# EAGLE design femtoBeacon_PRO_r3.0.0_single_sided (EAGLE 7.5.0)

## Sheet 1 of 2
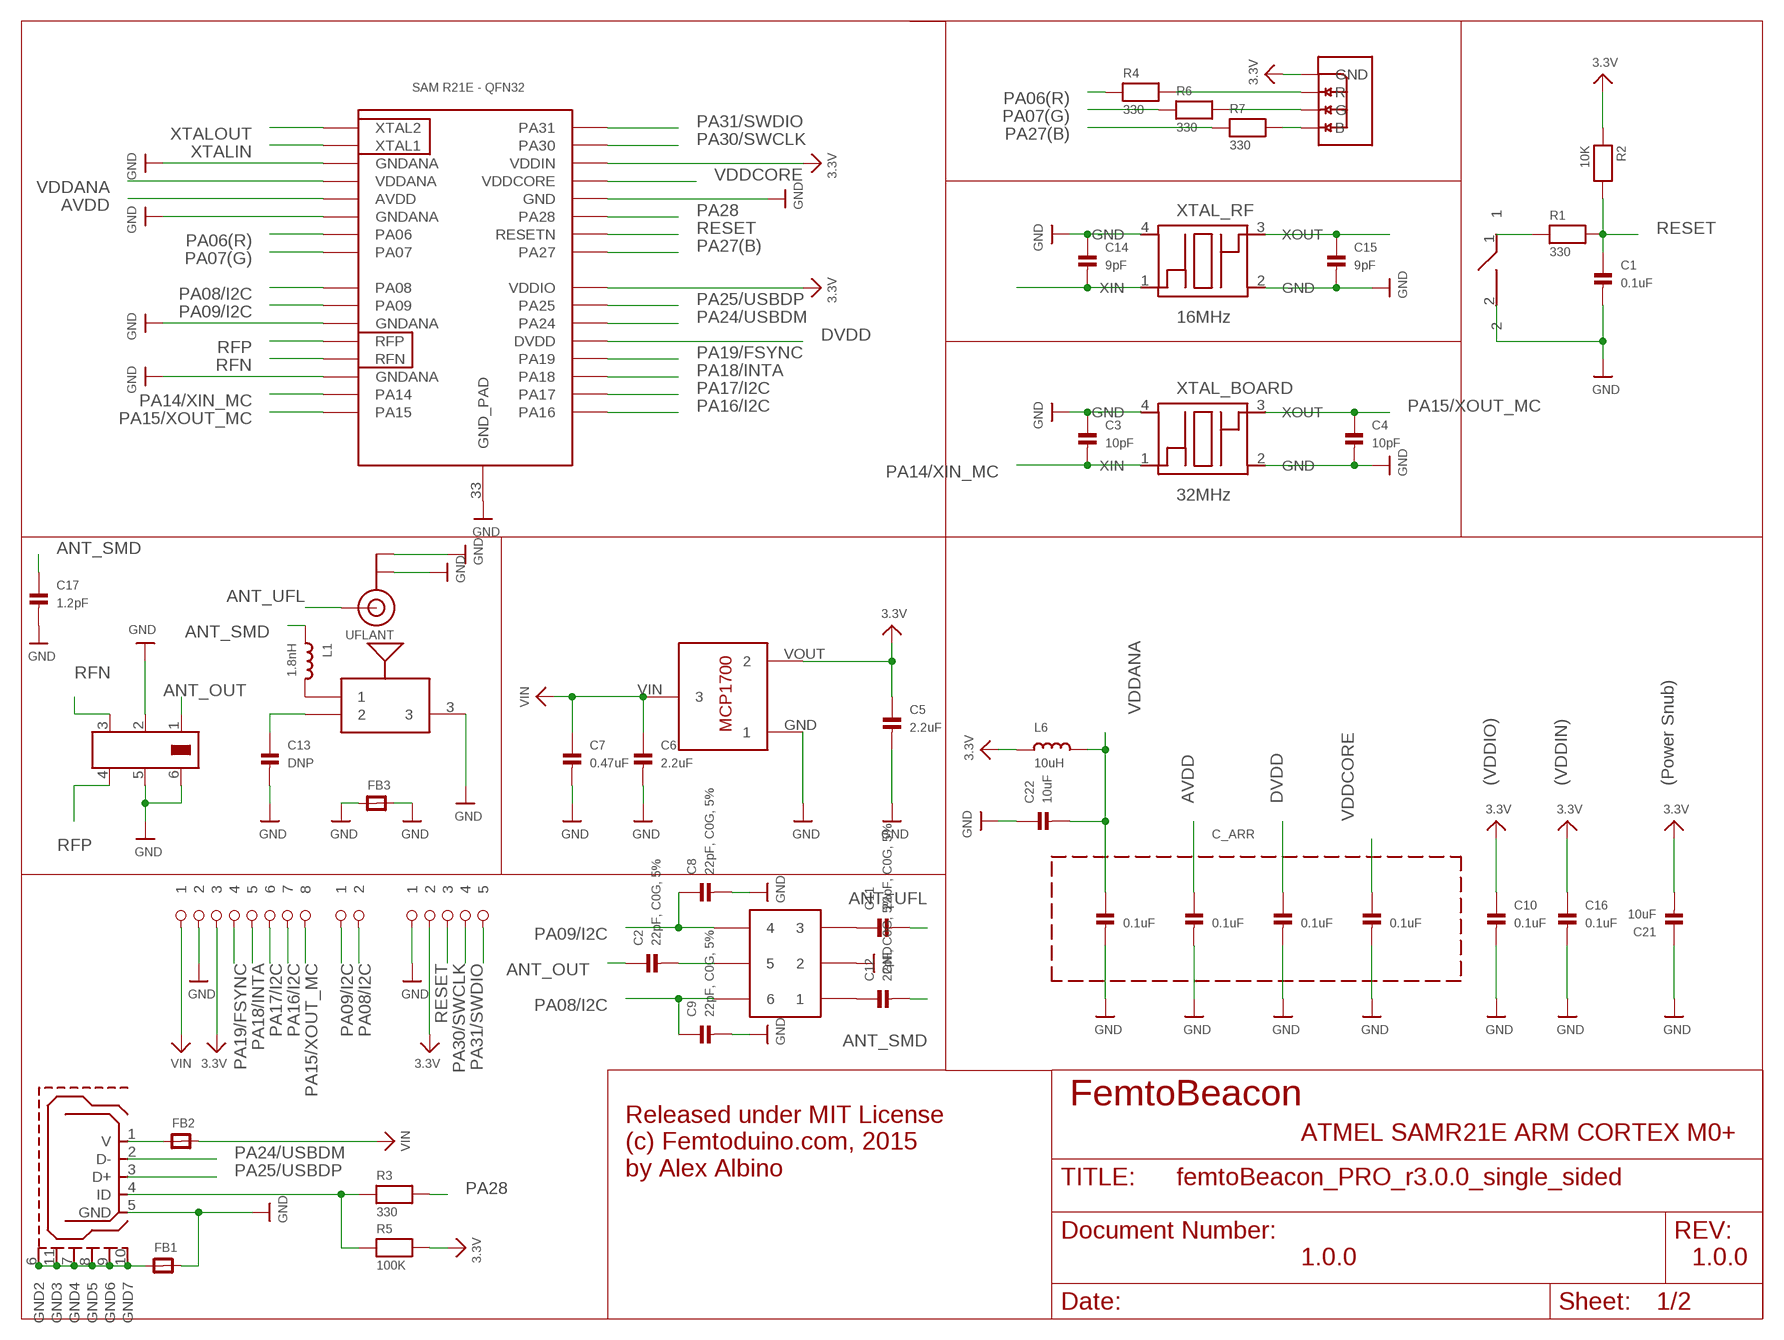
[diagram p0: schematic, sheet 1]

### Parts
ASWITCH  AS222-92LF  [AS222-92LF]
BALUN  JOHANSON_2450BM15A0015E  [0805_BALUN]
BTN_RESET  DNP  SPST_SMD  [SPST_SMD]
C1  0.1uF  CAP_CERAMIC_0402MP  [_0402MP]
C2  22pF, C0G, 5%  CAP_CERAMIC_0402MP  [_0402MP]
C3  10pF  CAP_CERAMIC_0402MP  [_0402MP]
C4  10pF  CAP_CERAMIC_0402MP  [_0402MP]
C5  2.2uF  CAP_CERAMIC_0402MP  [_0402MP]
C6  2.2uF  CAP_CERAMIC_0402MP  [_0402MP]
C7  0.47uF  CAP_CERAMIC_0402MP  [_0402MP]
C8  22pF, C0G, 5%  CAP_CERAMIC_0402MP  [_0402MP]
C9  22pF, C0G, 5%  CAP_CERAMIC_0402MP  [_0402MP]
C10  0.1uF  CAP_CERAMIC_0402MP  [_0402MP]
C11  22pF, C0G, 5%  CAP_CERAMIC_0402MP  [_0402MP]
C12  22pF, C0G, 5%  CAP_CERAMIC_0402MP  [_0402MP]
C13  DNP  CAP_CERAMIC_0402MP  [_0402MP]
C14  9pF  CAP_CERAMIC_0402MP  [_0402MP]
C15  9pF  CAP_CERAMIC_0402MP  [_0402MP]
C16  0.1uF  CAP_CERAMIC_0402MP  [_0402MP]
C17  1.2pF  CAP_CERAMIC_0402MP  [_0402MP]
C21  10uF  CAP_CERAMIC_0402MP  [_0402MP]
C22  10uF  CAP_CERAMIC_0402MP  [_0402MP]
C_ARR  0.1uF  KEMET_CERAMIC_CAPACITOR_ARRAY_1X4  [CAPACITOR_ARRAY_1206_MONO_1X4]
FB1  FERRITE_0603MP  [_0603MP]
FB2  FERRITE_0603MP  [_0603MP]
FB3  FERRITE_0603MP  [_0603MP]
IC  ATSAMR21E18A-MUT  [QFN32]
L1  1.8nH  INDUCTOR_0603MP  [_0603MP]
L6  10uH  INDUCTOR_0603MP  [_0603MP]
LDO_VREG  MCP1700T-3302E/TT  [MCP1700T-3302E/TT]
R1  330  RESISTOR_0402MP  [_0402MP]
R2  10K  RESISTOR_0402MP  [_0402MP]
R3  330  RESISTOR_0402MP  [_0402MP]
R4  330  RESISTOR_0402MP  [_0402MP]
R5  100K  RESISTOR_0402MP  [_0402MP]
R6  330  RESISTOR_0402MP  [_0402MP]
R7  330  RESISTOR_0402MP  [_0402MP]
RGBLED  LRTB_R48G  [LRTB_R48G]
SMDANT  PULSE_ANT_2.4GHZ  [ANT_BAR]
U$5  1X8_ROUND  [1X8_ROUND]
U$9  1X2_ROUND  [1X2_ROUND]
U$10  1X5_ROUND  [1X5_ROUND]
UFLANT  ANTENNA_U.FL  [U.FL]
USB  USB_MICROB  [USB_MICROB_PACKAGE]
XTAL_BOARD  32MHz  FA-128  [FA-128]
XTAL_RF  16MHz  TSX-3225  [TSX-3225]

### Nets
3.3V: C5.1 C10.1 C16.1 C21.2 IC.24(VDDIO) IC.30(VDDIN) L6.1 LDO_VREG.VOUT R2.1 R5.2 RGBLED.1(GND) U$5.P$3 U$10.P$2 ; also sheet 2
ANT_OUT: BALUN.1 C2.1
ANT_SMD: C12.2 C17.1 L1.1
ANT_UFL: C11.2 UFLANT.3(SIGNAL)
AVDD: C_ARR.3 IC.5(AVDD)
DVDD: C_ARR.5 IC.21(DVDD)
GND: ASWITCH.PIN2 BALUN.2 BALUN.5 BALUN.6 BTN_RESET.2 C1.2 C3.1 C4.2 C5.2 C6.2 C7.2 C8.2 C9.2 C10.2 C13.2 C14.1 C15.2 C16.2 C17.2 C21.1 C22.1 C_ARR.2 C_ARR.4 C_ARR.6 C_ARR.8 FB1.2 FB3.1 FB3.2 IC.3(GNDANA) IC.6(GNDANA) IC.11(GNDANA) IC.14(GNDANA) IC.28(GND) IC.33(GND_PAD) LDO_VREG.GND SMDANT.3 U$5.P$2 U$10.P$1 UFLANT.1(GND) UFLANT.2(GND) USB.5(GND) XTAL_BOARD.2(GND) XTAL_BOARD.4(GND) XTAL_RF.2(GND) XTAL_RF.4(GND) ; also sheet 2
N$1: L1.2 SMDANT.1
N$2: C13.1 SMDANT.2
N$3: ASWITCH.PIN5 C2.2
N$5: FB1.1 USB.6(GND2) USB.7(GND4) USB.8(GND5) USB.9(GND6) USB.10(GND7) USB.11(GND3)
N$6: R3.1 R5.1 USB.4(ID)
N$7: FB2.1 USB.1(V)
N$8: R6.2 RGBLED.3(G)
N$9: R7.2 RGBLED.4(B)
N$10: ASWITCH.PIN3 C11.1
N$11: ASWITCH.PIN1 C12.1
N$13: R4.2 RGBLED.2(R)
N$26: BTN_RESET.1 R1.1
PA06(R): IC.7(PA06) R4.1
PA07(G): IC.8(PA07) R6.1
PA08/I2C: ASWITCH.PIN6 C9.1 IC.9(PA08) U$9.P$2
PA09/I2C: ASWITCH.PIN4 C8.1 IC.10(PA09) U$9.P$1
PA14/XIN_MC: C3.2 IC.15(PA14) XTAL_BOARD.1(XIN)
PA15/XOUT_MC: C4.1 IC.16(PA15) U$5.P$8 XTAL_BOARD.3(XOUT)
PA16/I2C: IC.17(PA16) U$5.P$7 ; also sheet 2
PA17/I2C: IC.18(PA17) U$5.P$6 ; also sheet 2
PA18/INTA: IC.19(PA18) U$5.P$5 ; also sheet 2
PA19/FSYNC: IC.20(PA19) U$5.P$4 ; also sheet 2
PA24/USBDM: IC.22(PA24) USB.2(D-)
PA25/USBDP: IC.23(PA25) USB.3(D+)
PA27(B): IC.25(PA27) R7.1
PA28: IC.27(PA28) R3.2
PA30/SWCLK: IC.31(PA30) U$10.P$4
PA31/SWDIO: IC.32(PA31) U$10.P$5
RESET: C1.1 IC.26(RESETN) R1.2 R2.2 U$10.P$3
RFN: BALUN.3 IC.13(RFN)
RFP: BALUN.4 IC.12(RFP)
VDDANA: C22.2 C_ARR.1 IC.4(VDDANA) L6.2
VDDCORE: C_ARR.7 IC.29(VDDCORE)
VIN: C6.1 C7.1 FB2.2 LDO_VREG.VIN U$5.P$1
XTALIN: C14.2 IC.2(XTAL1) XTAL_RF.1(XIN)
XTALOUT: C15.1 IC.1(XTAL2) XTAL_RF.3(XOUT)

### Notes on the sheet
- (VDDIO) | (VDDIN) | (Power Snub)
- FemtoBeacon
- ATMEL SAMR21E ARM CORTEX M0+
- Released under MIT License
  (c) Femtoduino.com, 2015
  by Alex Albino
- 1.0.0 | 1.0.0

## Sheet 2 of 2
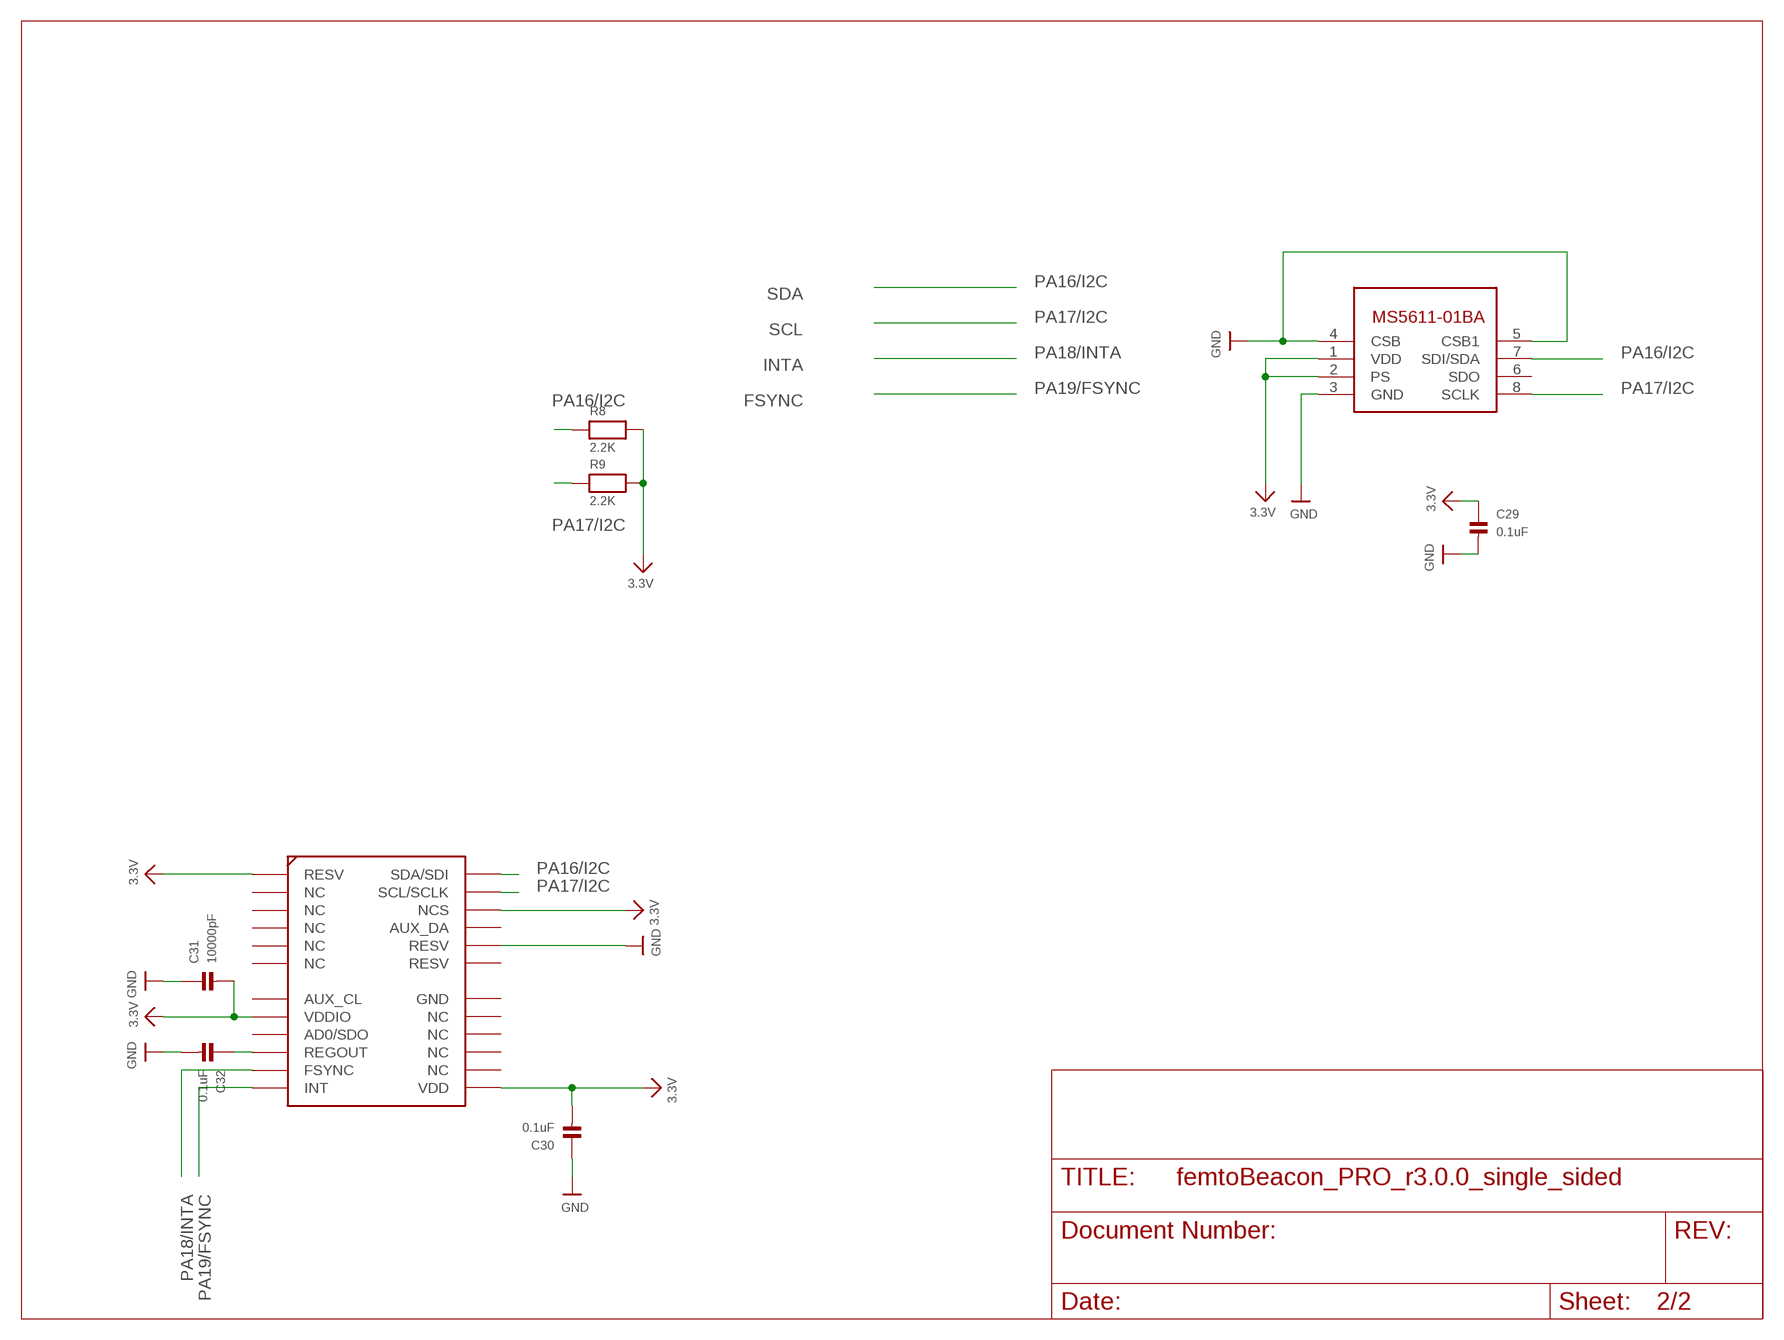
[diagram p1: schematic, sheet 2]

### Parts
BARO  MS5611-01BA03  [MS5611-01BA03]
C29  0.1uF  CAP_CERAMIC_0402MP  [_0402MP]
C30  0.1uF  CAP_CERAMIC_0402MP  [_0402MP]
C31  10000pF  CAP_CERAMIC_0402MP  [_0402MP]
C32  0.1uF  CAP_CERAMIC_0402MP  [_0402MP]
IMU  MPU-9250  [QFN_3X3MM]
R8  2.2K  RESISTOR_0402MP  [_0402MP]
R9  2.2K  RESISTOR_0402MP  [_0402MP]

### Nets
3.3V: BARO.1(VDD) BARO.2(PS) C29.1 C30.2 C31.2 IMU.P$1(RESV) IMU.P$8(VDDIO) IMU.P$13(VDD) IMU.P$22(NCS) R8.2 R9.2 ; also sheet 1
GND: BARO.3(GND) BARO.4(CSB) BARO.5(CSB1) C29.2 C30.1 C31.1 C32.2 IMU.P$20(RESV) ; also sheet 1
N$4: C32.1 IMU.P$10(REGOUT)
PA16/I2C: BARO.7(SDI/SDA) IMU.P$24(SDA/SDI) R8.1 ; also sheet 1
PA17/I2C: BARO.8(SCLK) IMU.P$23(SCL/SCLK) R9.1 ; also sheet 1
PA18/INTA: IMU.P$11(FSYNC) ; also sheet 1
PA19/FSYNC: IMU.P$12(INT) ; also sheet 1
Unconnected: BARO.6(SDO) IMU.P$2(NC) IMU.P$3(NC) IMU.P$4(NC) IMU.P$5(NC) IMU.P$6(NC) IMU.P$7(AUX_CL) IMU.P$9(AD0/SDO) IMU.P$14(NC) IMU.P$15(NC) IMU.P$16(NC) IMU.P$17(NC) IMU.P$18(GND) IMU.P$19(RESV) IMU.P$21(AUX_DA)

### Notes on the sheet
- SDA
- SCL
- INTA
- FSYNC

## Library data of the parts
ASWITCH = skyworks_solutions:AS222-92LF
BALUN = balun:JOHANSON_2450BM15A0015E
BARO = freeimu:MS5611-01BA03
BTN_RESET = femtoduino:SPST_SMD
C1-C4 C8-C16 C29-C32 = microbuilder:CAP_CERAMIC: Ceramic Capacitors 0402 - 0402 Surface Mount Capacitors 16pF 50V 5% [Digikey: 445-4899-2-ND] 18pF 50V 5% [Digikey: 490-1281-2-ND] 22pF 50V 5% [Digikey: 490-1283-2-ND] 68pF 50V 5% [Digikey: 490-1289-2-ND] 0.1uF 10V 10% [Digikey: 490-1318-2-ND] 1.0uF 6.3V 10% [Digikey: 490-1320-2-ND] 0603 - 0603 Surface Mount Capacitors 16 pF 50V 5% [Digikey: 445-5051-2-ND] 22 pF 50V [Digikey: PCC220ACVTR-ND] 33 pF 50V 5% [Digikey: 490-1415-1-ND] 56pF 50V 5% [Digikey: 490-1421-1-ND] 220pF 50V 5% [Digikey: 445-1285-1-ND] 680 pF 50V 2200 pF 50V 5% C0G [Digikey: 445-1297-1-ND] 5600 pF 100V 5% X7R [Digikey: 478-3711-1-ND] 0.1 µF 25V 10% [Digikey: PCC2277TR-ND] 0.22 µF 16V 10% X7R [Digikey: 445-1318-1-ND] 1.0 µF 25V 10% [Digikey: 445-5146-2-ND] 0603 - RF Specific 3pF 250V +/-0.1pF RF [Digikey: 712-1347-1-ND] 18 pF 250V 5% [Digikey: 478-3505-1-ND or 712-1322-1-ND] 56 pF 250V 5% C0G RF [Digikey: 490-4867-1-ND] 68 pF 250V RF [Digikey: 490-4868-1-ND] 0805 - 0805 Surface Mount Capacitors 220 pF 250V 2% RF Ceramic Capacitor [Digikey: 712-1398-1-ND] 1000 pF 50V 2% NP0 Ceramic Capacitor [Digikey: 478-3760-1-ND] 0.1 µF 25V 10% Ceramic Capacitor [Digikey: PCC1828TR-ND] 1.0 µF 16V 10% Ceramic Capacitor[Digikey: 490-1691-2-ND] 10.0 µF 10V 10% Ceramic Capacitor[Digikey: 709-1228-1-ND] 10.0 uF 16V 10% Ceramic Capacitor [Digikey: 478-5165-2-ND] 47 uF 6.3V 20% Ceramic Capacitor [Digikey: 587-1779-1-ND or 399-5506-1-ND] 1206 - 1206 Surface Mount Capacitors 47uF 10V 20% Ceramic Capacitor [Digikey: 490-5528-1-ND or 399-5508-1-ND or 445-6010-1-ND] 100uF 6.3V -20%, +80% Y5V Ceramic Capacitor (Digikey: 490-4512-1-ND, Mouser: 81-GRM31CF50J107ZE1L); DIGIKEY_PART: 490-3194-1-ND
C5-C7 C17 C21 C22 = microbuilder:CAP_CERAMIC: Ceramic Capacitors 0402 - 0402 Surface Mount Capacitors 16pF 50V 5% [Digikey: 445-4899-2-ND] 18pF 50V 5% [Digikey: 490-1281-2-ND] 22pF 50V 5% [Digikey: 490-1283-2-ND] 68pF 50V 5% [Digikey: 490-1289-2-ND] 0.1uF 10V 10% [Digikey: 490-1318-2-ND] 1.0uF 6.3V 10% [Digikey: 490-1320-2-ND] 0603 - 0603 Surface Mount Capacitors 16 pF 50V 5% [Digikey: 445-5051-2-ND] 22 pF 50V [Digikey: PCC220ACVTR-ND] 33 pF 50V 5% [Digikey: 490-1415-1-ND] 56pF 50V 5% [Digikey: 490-1421-1-ND] 220pF 50V 5% [Digikey: 445-1285-1-ND] 680 pF 50V 2200 pF 50V 5% C0G [Digikey: 445-1297-1-ND] 5600 pF 100V 5% X7R [Digikey: 478-3711-1-ND] 0.1 µF 25V 10% [Digikey: PCC2277TR-ND] 0.22 µF 16V 10% X7R [Digikey: 445-1318-1-ND] 1.0 µF 25V 10% [Digikey: 445-5146-2-ND] 0603 - RF Specific 3pF 250V +/-0.1pF RF [Digikey: 712-1347-1-ND] 18 pF 250V 5% [Digikey: 478-3505-1-ND or 712-1322-1-ND] 56 pF 250V 5% C0G RF [Digikey: 490-4867-1-ND] 68 pF 250V RF [Digikey: 490-4868-1-ND] 0805 - 0805 Surface Mount Capacitors 220 pF 250V 2% RF Ceramic Capacitor [Digikey: 712-1398-1-ND] 1000 pF 50V 2% NP0 Ceramic Capacitor [Digikey: 478-3760-1-ND] 0.1 µF 25V 10% Ceramic Capacitor [Digikey: PCC1828TR-ND] 1.0 µF 16V 10% Ceramic Capacitor[Digikey: 490-1691-2-ND] 10.0 µF 10V 10% Ceramic Capacitor[Digikey: 709-1228-1-ND] 10.0 uF 16V 10% Ceramic Capacitor [Digikey: 478-5165-2-ND] 47 uF 6.3V 20% Ceramic Capacitor [Digikey: 587-1779-1-ND or 399-5506-1-ND] 1206 - 1206 Surface Mount Capacitors 47uF 10V 20% Ceramic Capacitor [Digikey: 490-5528-1-ND or 399-5508-1-ND or 445-6010-1-ND] 100uF 6.3V -20%, +80% Y5V Ceramic Capacitor (Digikey: 490-4512-1-ND, Mouser: 81-GRM31CF50J107ZE1L)
C_ARR = array-capacitor:KEMET_CERAMIC_CAPACITOR_ARRAY_1X4; MFR_ID: CA064C104K4RACTU
FB1-FB3 = microbuilder:FERRITE: Ferrite Bead 0603 MMZ1608B121C - 120 Ohm @ 100MHz, 600mA, 0.15 Ohm DC Resistance - Digikey: 445-2164-1-ND BK1608HW121-T - 120 Ohm, 600mA Ferrite Chip - Digikey: 587-1876-2-ND 0805 HZ0805B272R-10 - 2.7K Ohm @ 100MHz, 200mA, 0.8 Ohm DC Resistance - Digikey: 240-2504-1-ND (see also Murata BLM21BD272SN1L) MMZ2012Y152B - 1.5K Ohm @ 100MHz, 500mA, 0.4 Ohm DC Resistance - Digikey: 445-1560-1-ND - Mainly for high frequency (80-400MHz) MMZ2012R102A - 1K Ohm @ 100MHz, 500mA, 0.3 Ohm DC Resistance - Digikey: 445-1555-2-ND - More general purpose (10-200MHz)
IC = atmel-samr21:ATSAMR21E18A-MUT: This is the ATMEL SAMR21E QFN-32. ATSAMR21E18A
IMU = mpu9250:MPU-9250
L1 = microbuilder:INDUCTOR: Inductors 0603: 10nH Ceramic Inductor - microwire antenna/RF (Digikey: 712-1434-2-ND) 0805: 560nH Ceramic Inductor - RF (Digikey: 553-1047-1-ND) 270nH Ceramic Inductor - Q = 40@250MHz, +-5%, 1 Ohm DC Resistance (Digikey: 535-10506-2-ND) 1007 (2518 Metric) SMT: 10µH 10% 250mOhm 820mA 1007 Inductor (Digikey: 587-2189-1-ND) 22µH 10% 500mOhm 580mA 1007 Inductor (Digikey: 587-2190-1-ND) 47µH 10% 950mOhm 420mA 1007 Inductor (Digikey: 587-2191-1-ND) 47µH 5% 100mOhm 1A 1008 Inductor (Digikey: 732-1816-1-ND) 5.0x5.0mm (Taiyo Yuden NR5040 Series) 6.8µH 20% 2.3A 64mOhm Inductor (Digikey: 587-2374-2-ND) 5.0x5.0mm (TDK VLC5045 Series) 4.7µH 20% 3.3A 34mOhm Inductor (Digikey: 445-6526-1-ND) 6.8µH 20% 2.7A 46mOhm Inductor (Digikey: 445-6527-1-ND) 6.0x6.0mm (TDK VLC6045 Series) 4.7µH 20% 3.8A 27mOhm Inductor (Digikey: 445-6538-2-ND) 6.8µH 20% 3A 41mOhm Inductor (Digikey: 445-6540-1-ND) 6.2µH 30% 2.2A 45mOhm Inductor (Digikey: SRR5028-6R2YCT-ND) - Not TDK VLC6045 but footprint should match 6.0x6.0mm (TDK SLF6045 Series) 6.8uH 30% 2A 33mOhm Inductor (Digikey: 445-4572-1-ND, Mouser: 810-SLF645T6R8N2R0PF); MFR_ID: L-05B1N8SV6T
L6 = microbuilder:INDUCTOR: Inductors 0603: 10nH Ceramic Inductor - microwire antenna/RF (Digikey: 712-1434-2-ND) 0805: 560nH Ceramic Inductor - RF (Digikey: 553-1047-1-ND) 270nH Ceramic Inductor - Q = 40@250MHz, +-5%, 1 Ohm DC Resistance (Digikey: 535-10506-2-ND) 1007 (2518 Metric) SMT: 10µH 10% 250mOhm 820mA 1007 Inductor (Digikey: 587-2189-1-ND) 22µH 10% 500mOhm 580mA 1007 Inductor (Digikey: 587-2190-1-ND) 47µH 10% 950mOhm 420mA 1007 Inductor (Digikey: 587-2191-1-ND) 47µH 5% 100mOhm 1A 1008 Inductor (Digikey: 732-1816-1-ND) 5.0x5.0mm (Taiyo Yuden NR5040 Series) 6.8µH 20% 2.3A 64mOhm Inductor (Digikey: 587-2374-2-ND) 5.0x5.0mm (TDK VLC5045 Series) 4.7µH 20% 3.3A 34mOhm Inductor (Digikey: 445-6526-1-ND) 6.8µH 20% 2.7A 46mOhm Inductor (Digikey: 445-6527-1-ND) 6.0x6.0mm (TDK VLC6045 Series) 4.7µH 20% 3.8A 27mOhm Inductor (Digikey: 445-6538-2-ND) 6.8µH 20% 3A 41mOhm Inductor (Digikey: 445-6540-1-ND) 6.2µH 30% 2.2A 45mOhm Inductor (Digikey: SRR5028-6R2YCT-ND) - Not TDK VLC6045 but footprint should match 6.0x6.0mm (TDK SLF6045 Series) 6.8uH 30% 2A 33mOhm Inductor (Digikey: 445-4572-1-ND, Mouser: 810-SLF645T6R8N2R0PF)
LDO_VREG = MCP1700T-3302E_TT:MCP1700T-3302E/TT: Microchip LDO "MCP1700" in a 3-Pin SOT-23 package. ID: MCP1700T-3302E/TT
R1-R9 = microbuilder:RESISTOR: Resistors 0402 - 0402 Surface Mount Package 22 Ohm 1% 1/16W [Digikey: 311-22.0LRTR-ND] 33 Ohm 5% 1/16W 1.0K 5% 1/16W 1.5K 5% 1/16W 2.0K 1% 1/16W 10.0K 1% 1/16W [Digikey: 311-10.0KLRTR-ND] 10.0K 5% 1/16W [Digikey: RMCF0402JT10K0TR-ND] 12.1K 1% 1/16W [Digikey: 311-22.0LRTR-ND] 100.0K 5% 1/16W 0603 - 0603 Surface Mount Package 0 Ohm 1/10 Watt 1% Resistor 15 Ohm 1/10 Watt 1% Resistor 33 Ohm 1/10 Watt 1% Resistor 49.9 Ohm 1/10 Watt 1% Resistor 100 Ohm 1/10 Watt 1% Resistor 150 Ohm 1/10 Watt 1% Resistor 240 Ohm 1/10 Watt 1% Resistor 390 Ohm 1/10 Watt 1% Resistor 560 Ohm 1/10 Watt 1% Resistor 680 Ohm 1/10 Watt 1% Resistor 750 Ohm 1/10 Watt 1% Resistor 1.0K Ohm 1/10 Watt 1% Resistor 1.5K Ohm 1/10 Watt 1% Resistor 2.0K Ohm 1/10 Watt 1% Resistor 2.2K Ohm 1/10 Watt 1% Resistor 3.3K Ohm 1/10 Watt 1% Resistor 4.7K Ohm 1/10 Watt 1% Resistor 10.0K Ohm 1/10 Watt 1% Resistor 12.0K Ohm 1/10 Watt 1% Resistor 12.1K Ohm 1/10 Watt 1% Resistor 20.0K Ohm 1/10 Watt 1% Resistor 33.0K Ohm 1/10 Watt 1% Resistor 100.0K Ohm 1/10 Watt 1% Resistor 0805 - 0805 Surface Mount Package 0 Ohm 1/8 Watt 1% Resistor 33 Ohm 1/8 Watt 1% Resistor 100 Ohm 1/8 Watt 1% Resistor 150 Ohm 1/8 Watt 1% Resistor 200 Ohm 1/8 Watt 1% Resistor 240 Ohm 1/8 Watt 1% Resistor 330 Ohm 1/8 Watt 1% Resistor 390 Ohm 1/8 Watt 1% Resistor 470 Ohm 1/8 Watt 1% Resistor 1.0K Ohm 1/8 Watt 1% Resistor 1.5K Ohm 1/8 Watt 1% Resistor 2.0K Ohm 1/8 Watt 1% Resistor 4.7K Ohm 1/8 Watt 1% Resistor 5.1K Ohm 1/8 Watt 1% Resistor 5.6K Ohm 1/8 Watt 1% Resistor 10.0K Ohm 1/8 Watt 1% Resistor 22.0K Ohm 1/8 Watt 1% Resistor 33.0K Ohm 1/8 Watt 1% Resistor 100K Ohm 1/8 Watt 1% Resistor 1206 - 1206 Surface Mount Package 2012 - 2010 Surface Mount Package 0.11 Ohm 1/2 Watt 1% Resistor - Digikey: RHM.11UCT-ND
RGBLED = osram_opto_LED:LRTB_R48G; MFR_ID: LRTB R48G
SMDANT = bar_antenna:PULSE_ANT_2.4GHZ: Manufacturer part #W3008
U$5 = pins_1.27mm_pitch:1X8_ROUND
U$9 = pins_1.27mm_pitch:1X2_ROUND
U$10 = pins_1.27mm_pitch:1X5_ROUND
UFLANT = adafruit:ANTENNA_U.FL: U.FL Antenna Connector
USB = femtoduino:USB_MICROB: This is the hirose ZX62-B-5PA(11) MICRO-USB B Type female connection.
XTAL_BOARD = crystals:FA-128
XTAL_RF = crystals:TSX-3225

## Board
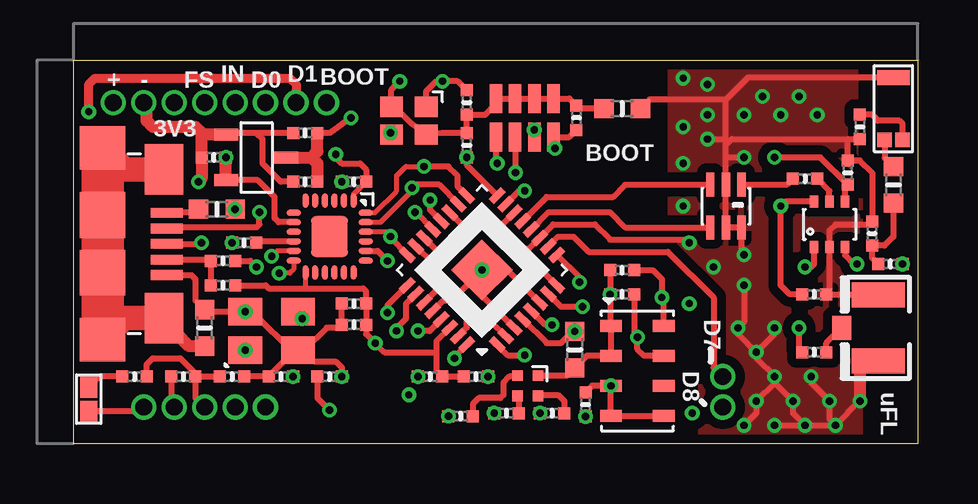
[diagram p2: board, top side]
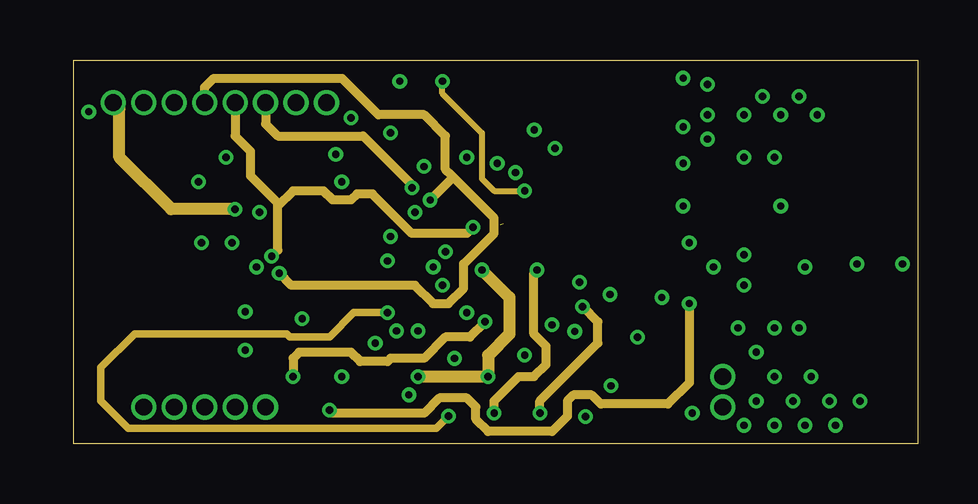
[diagram p3: board, inner layer Route2]
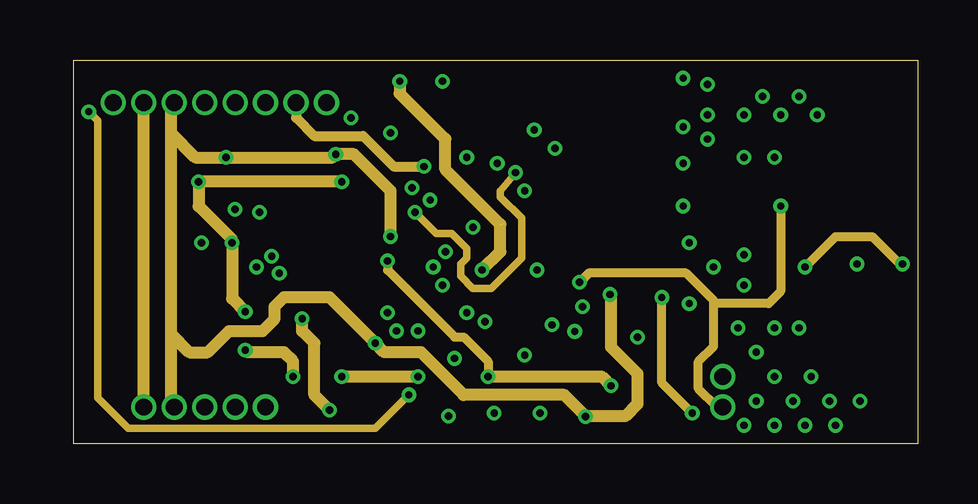
[diagram p4: board, inner layer Route15]
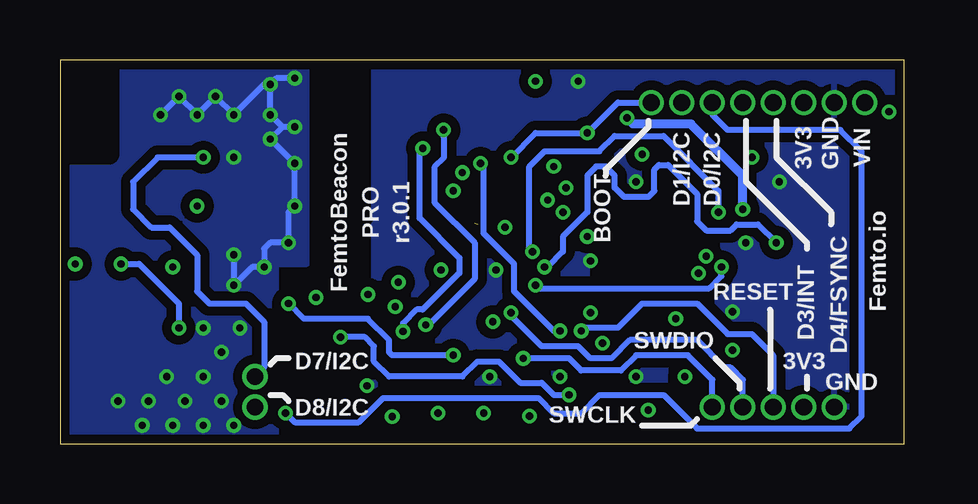
[diagram p5: board, bottom side, seen from below]

Size 35.18 x 16 mm. Coordinates in mm from the lower left corner, seen from the top.
Outline: 0,0 0,16 35.18,16 35.18,0 0,0
Copper layers (1*2*15*16): Top 0.035mm / dielectric 0.23mm / Route2 0.035mm / dielectric 0.93mm / Route15 0.035mm / dielectric 0.23mm / Bottom 0.035mm
Design rules "MF_Standard_4_Layer": minimum track width 6mil, minimum drill 12mil, track to track 6mil, track to pad 6mil, pad to pad 6mil, via to via 6mil, smd to smd 0mil, copper to edge 10mil, drill to drill 10mil, minimum pad ring 6mil, minimum via ring 6mil, stop-mask expansion 2mil, vias tented up to drill 25mil, thermal gap 10mil
tRestrict: area 33.1,12.1 to 35.2,16; area 9.1,7.1 to 12.2,10.2
bRestrict: area 33.1,12.1 to 35.2,16; area 9.1,7.1 to 12.2,10.2

### Footprints (pad centres in the part's own frame; a part is rotated, then mirrored left to right if it is on the bottom)
AS222-92LF = smd 0.35 x 0.5: PIN1 -0.65,-0.95; PIN2 0,-0.95; PIN3 0.65,-0.95; PIN4 0.65,0.95; PIN5 0,0.95; PIN6 -0.65,0.95
0805_BALUN = smd 1 x 0.35: 1 -0.9,0.65; 2 -0.9,0; 3 -0.9,-0.65; 4 0.9,-0.65; 5 0.9,0; 6 0.9,0.65
MS5611-01BA03 = smd 0.9 x 0.5: 1 -1.1,1.875; 2 -1.1,0.625; 3 -1.1,-0.625; 4 -1.1,-1.875; 5 1.1,-1.875; 6 1.1,-0.625; 7 1.1,0.625; 8 1.1,1.875
SPST_SMD = smd 0.889 x 0.699: 1 -0.508,0; 2 0.508,0
_0402MP = smd 0.5 x 0.5: 1 -0.508,0; 2 0.508,0
CAPACITOR_ARRAY_1206_MONO_1X4 = smd 0.52 x 1.2: 1 -1.2,0.8; 2 -1.2,-0.8; 3 -0.4,0.8; 4 -0.4,-0.8; 5 0.4,0.8; 6 0.4,-0.8; 7 1.2,0.8; 8 1.2,-0.8
_0603MP = smd 0.8 x 0.8: 1 -0.762,0; 2 0.762,0
QFN32 = smd 0.7 x 0.3: 1 -2.65,1.75; 2 -2.65,1.25; 3 -2.65,0.75; 4 -2.65,0.25; 5 -2.65,-0.25; 6 -2.65,-0.75; 7 -2.65,-1.25; 8 -2.65,-1.75; 17 2.65,-1.75; 18 2.65,-1.25; 19 2.65,-0.75; 20 2.65,-0.25; 21 2.65,0.25; 22 2.65,0.75; 23 2.65,1.25; 24 2.65,1.75 | smd 0.3 x 0.7: 9 -1.75,-2.65; 10 -1.25,-2.65; 11 -0.75,-2.65; 12 -0.25,-2.65; 13 0.25,-2.65; 14 0.75,-2.65; 15 1.25,-2.65; 16 1.75,-2.65; 25 1.75,2.65; 26 1.25,2.65; 27 0.75,2.65; 28 0.25,2.65; 29 -0.25,2.65; 30 -0.75,2.65; 31 -1.25,2.65; 32 -1.75,2.65 | smd 1.8 x 1.8: 33 0,0
QFN_3X3MM = smd 0.6 x 0.25: P$1 -1.5,1; P$2 -1.5,0.6; P$3 -1.5,0.2; P$4 -1.5,-0.2; P$5 -1.5,-0.6; P$6 -1.5,-1; P$13 1.5,-1; P$14 1.5,-0.6; P$15 1.5,-0.2; P$16 1.5,0.2; P$17 1.5,0.6; P$18 1.5,1 | smd 0.25 x 0.6: P$7 -1,-1.5; P$8 -0.6,-1.5; P$9 -0.2,-1.5; P$10 0.2,-1.5; P$11 0.6,-1.5; P$12 1,-1.5; P$19 1,1.5; P$20 0.6,1.5; P$21 0.2,1.5; P$22 -0.2,1.5; P$23 -0.6,1.5; P$24 -1,1.5 | smd 1.7 x 1.54: P$25 0,0
MCP1700T-3302E/TT = smd 0.5 x 1: GND -0.95,-1.25; VIN 0,1.25; VOUT 0.95,-1.25
LRTB_R48G = smd 0.45 x 0.45: 1 0.425,0.425; 2 0.425,-0.425; 3 -0.425,-0.425; 4 -0.425,0.425
ANT_BAR = smd 0.62 x 0.61: 1 -1.3,0.37; 2 -1.3,-0.38 | smd 0.62 x 1.36: 3 1.3,0
1X8_ROUND = drill 0.7 pad 1: P$1 0,0; P$2 0,-1.27; P$3 0,-2.54; P$4 0,-3.81; P$5 0,-5.08; P$6 0,-6.35; P$7 0,-7.62; P$8 0,-8.89
1X2_ROUND = drill 0.7 pad 1: P$1 0,0; P$2 0,-1.27
1X5_ROUND = drill 0.7 pad 1: P$1 0,0; P$2 0,-1.27; P$3 0,-2.54; P$4 0,-3.81; P$5 0,-5.08
U.FL = smd 2.2 x 1.05: 1 0,1.375; 2 0,-1.375 | smd 0.8 x 1: 3 1.525,0
USB_MICROB_PACKAGE = smd 0.4 x 1.35: 1 -1.3,1.47; 2 -0.64,1.47; 3 0,1.47; 4 0.66,1.47; 5 1.3,1.47 | smd 2.1 x 1.6: 6 -3.1,1.35; 11 3.1,1.35 | smd 1.8 x 1.9: 7 -4,-1.2; 10 4,-1.2 | smd 1.9 x 1.9: 8 -1.2,-1.2; 9 1.2,-1.2
FA-128 = smd 0.95 x 0.85: 1 -0.725,-0.575; 2 0.725,-0.575; 3 0.725,0.575; 4 -0.725,0.575
TSX-3225 = smd 1.4 x 1.15: 1 -1.1,-0.8; 2 1.1,-0.8; 3 1.1,0.8; 4 -1.1,0.8

### Placement (x,y rotation side)
ASWITCH  31.5,9.14 0 top
BALUN  27.18,9.91 270 top
BARO  23.49,3.04 0 top
BTN_RESET  0.64,1.85 270 top
C1  6.6,2.79 0 top
C2  30.48,11.05 0 top
C3  16.38,14.22 90 top
C4  16.38,12.45 90 top
C5  5.84,11.94 180 top
C6  9.65,12.95 180 top
C7  9.65,10.92 180 top
C8  32.26,11.3 90 top
C9  30.86,6.22 0 top
C10  11.68,10.92 180 top
C11  30.86,3.81 0 top
C12  34.04,7.49 180 top
C13  32.77,13.21 270 top
C14  8.64,2.79 0 top
C15  10.67,2.79 0 top
C16  16.76,2.79 0 top
C17  33.27,8.76 90 top
C21  14.86,2.79 0 top
C22  20.95,13.59 270 top
C29  21.34,1.64 90 top
C30  11.68,4.95 0 top
C31  11.68,5.84 0 top
C32  7.11,8.38 180 top
C_ARR  18.8,13.59 180 top
FB1  5.46,4.83 90 top
FB2  5.97,9.78 0 top
FB3  22.86,13.97 0 top
IC  17.02,7.24 135 top
IMU  10.67,8.64 270 top
L1  34.16,10.79 90 top
L6  20.89,3.92 90 top
LDO_VREG  7.62,11.94 270 top
R1  2.54,2.79 0 top
R2  4.57,2.79 0 top
R3  6.22,7.62 0 top
R4  19.94,1.27 0 top
R5  6.22,6.6 0 top
R6  18.03,1.27 0 top
R7  16.13,1.14 0 top
R8  22.86,6.22 180 top
R9  22.86,7.24 180 top
RGBLED  18.92,2.41 0 top
SMDANT  34.16,13.97 90 top
U$5  1.65,14.22 90 top
U$9  27.05,2.79 0 top
U$10  2.92,1.52 90 top
UFLANT  33.53,4.83 180 top
USB  2.41,8.33 270 top
XTAL_BOARD  13.97,13.46 180 top
XTAL_RF  8.26,4.7 0 top

### Tracks (layer width: path | path; a pad name or v marks a point on that pad's centre or on a via)
3.3V  (via drill 0.3 pad 0.51)
  Top 0.203: IMU.P$13 9.65,7.12 9.65,6.48 | IMU.P$22 13.01,8.84 v13.21,8.64 | IMU.P$1 11.67,10.4 C10.1
  Top 0.254: IMU.P$8 8.54,9.24 8.38,9.4 8.38,10.29 7.68,10.99 LDO_VREG.VOUT | IC.24 13.21,8.57 v13.21,8.64 | v10.92,12.06 10.92,11.94 11.18,11.68 11.94,11.68 12.19,11.43 C10.1 | IC.30 15.11,4.27 15.11,3.81 | R2.1 4.06,1.65 U$10.P$2 | R5.2 8,6.6 8.13,6.48 9.65,6.48 12.06,6.48 12.19,6.35 C31.2 C30.2 12.19,4.57 v12.57,4.19 12.95,3.81 15.11,3.81 | C16.1 C21.2 15.11,3.05 15.11,3.81 | RGBLED.1 20.57,2.84 L6.1 21.39,3.66 BARO.2 BARO.1 22.39,6.19 R8.2 R9.2
  Top 0.508: LDO_VREG.VOUT 6.35,11.01 C5.1
  Route15 0.508: 4.06,4.57 4.83,3.81 5.59,3.81 6.48,4.7 7.87,4.7 8.38,5.21 8.38,5.71 8.76,6.1 10.67,6.1 v12.57,4.19 12.95,3.81 14.48,3.81 16.26,2.03 20.45,2.03 21.34,1.14 C29.1 21.35,1.14 22.99,1.14 23.5,1.65 23.5,2.92 22.39,4.03 22.39,6.19 R8.2 | 4.06,4.57 4.06,12.95 | 4.06,12.95 4.06,14.1 U$5.P$3 | 4.06,12.95 5.08,11.94 C5.1 10.79,11.94 v10.92,12.06 11.68,12.06 13.21,10.54 v13.21,8.64 | U$10.P$2 4.06,1.65 4.06,4.57
  other vias: 6.35,11.94 21.34,1.13 22.35,6.22
ANT_OUT
  Top 0.254: BALUN.1 29.73,10.81 C2.1
ANT_SMD
  Top 0.254: L1.1 34.16,8.64 33.78,8.26 C17.1 33.27,7.75 C12.2
ANT_UFL
  Top 0.254: C11.2 31.37,4.19 UFLANT.3
AVDD  (via drill 0.3 pad 0.51)
  Top 0.254: IC.5 19.66,4.95 v19.94,4.95 | v19.2,13.08 C_ARR.3
  Bottom 0.254: v19.94,4.95 19.81,4.95 17.91,6.86 17.91,8.38 19.56,10.03 19.56,11.56 19.18,11.94 19.18,12.77 C_ARR.3 v19.2,13.08
DVDD  (via drill 0.3 pad 0.51)
  Top 0.254: IC.21 14.25,9.65 v14.22,9.65 | C_ARR.5 18.4,11.45 v18.41,11.3
  Route15 0.305: v14.22,9.65 15.11,8.76 15.75,8.76 16.38,8.13 16.38,7.75 16.13,7.49 16.13,6.99 16.64,6.48 17.4,6.48 18.67,7.75 18.67,9.4 17.78,10.29 17.78,10.54 v18.41,11.3
GND  (via drill 0.3 pad 0.51)  (1 unrouted)
  Top 0.254: C6.2 7.62,12.95 | 7.62,12.95 6.44,12.95 LDO_VREG.GND | C7.2 8.64,10.92 7.87,11.68 7.87,12.7 7.62,12.95 | USB.5 4.91,7.03 5.08,6.86 5.08,5.97 FB1.2 5.55,5.5 XTAL_RF.4 7.32,5.33 7.62,5.33 9.05,3.9 XTAL_RF.2 | U$10.P$1 2.74,1.35 BTN_RESET.2 | C1.2 C14.1 8.89,3.56 9.01,3.56 XTAL_RF.2 | C29.2 21.6,2.41 BARO.3 BARO.4 22.41,1.14 24.57,1.14 BARO.5 | IC.3 17.02,6.18 IC.33 | IC.28 15.39,5.97 15.75,5.97 IC.33 | IC.6 18.08,7.24 | 18.08,7.24 IC.33 | 18.08,7.24 IC.33 | 17.02,8.3 IC.33 | XTAL_RF.2 9.56,3.9 10.03,3.43 10.92,3.43 11.18,3.17 C15.2 | C31.1 C30.1 11.05,4.83 10.54,4.83 9.61,3.9 XTAL_RF.2 | IMU.P$20 12.66,8.04 v13.08,7.62 | 27.18,11.94 BALUN.2 BALUN.5 BALUN.6 27.83,7.99 v27.94,7.87 | 27.18,11.94 27.18,12.45 | 27.18,12.45 27.18,12.7 | 27.18,12.7 27.18,14.35 | 27.18,14.35 28.1,15.27 SMDANT.3 | 27.18,14.35 24,14.35 FB3.2 | FB3.1 21.08,13.97 C22.1 20.66,14.39 C_ARR.2 C_ARR.4 C_ARR.6 C_ARR.8 17.6,14.17 17.14,13.72 C3.1 C4.2 15.36,12.95 XTAL_BOARD.4 14.65,13.08 14.48,13.08 14.1,13.34 13.17,14.26 XTAL_BOARD.2 13.24,14.77 v13.59,15.11 | 27.18,12.45 27.43,12.7 32.26,12.7 | UFLANT.2 31.39,6.2 C9.2 31.5,6.35 ASWITCH.PIN2 31.5,8.89 31.75,9.14 33.15,9.14 C17.2 33.27,11.3 32.77,11.81 C8.2 32.26,12.7 | v27.94,11.94 27.18,11.94 | v26.42,12.7 27.18,12.7 | v27.94,6.6 27.94,5.08 v27.69,4.83 27.69,4.57 v28.45,3.81 | v29.21,4.83 29.21,4.57 v28.45,3.81 | v28.45,3.81 28.45,3.56 v29.21,2.79 29.21,2.54 | 29.21,2.54 v28.45,1.78 28.45,1.27 v27.94,0.76 | 29.21,2.54 v29.97,1.78 29.97,1.27 v30.48,0.76 | v29.21,0.76 v30.48,0.76 | v30.48,0.76 v31.75,0.76 | v32.77,1.78 v31.75,0.76 | v30.73,2.79 30.73,2.54 v31.5,1.78 31.5,1.02 v31.75,0.76
  Top 0.254: 32.26,12.7 C13.2 | v25.65,8.38 25.53,8.51 22.35,8.51 21.72,9.14 19.98,9.14 IC.11 18.97,8.13 18.67,8.13 17.91,8.89 17.91,9.19 IC.14
  Top 0.508: LDO_VREG.GND 5.4,12.89 | 5.4,12.89 5.08,13.21 3.3,13.21 3.05,13.46 3.05,14.1 U$5.P$2 | 5.4,12.89 5.33,12.82 C5.2 5.33,11.05 v5.21,10.92 | UFLANT.1 33.04,3.45 32.77,3.17 v32.77,1.78
  Route2 0.508: IC.33 18.16,6.1 18.16,4.57 17.27,3.68 C16.2 C21.1
  Route15 0.381: v13.08,7.62 13.08,7.24 15.88,4.45 16.26,4.45 17.27,3.43 C16.2
  Route15 0.508: C10.2 v5.21,10.92 5.21,9.91 6.6,8.51 C32.2 6.6,6.05 XTAL_RF.4 | IC.33 17.78,8 17.78,9.14 15.49,11.43 15.49,12.7 13.59,14.61 v13.59,15.11 | C15.2 C21.1 | C16.2 22.01,2.79 BARO.3 | U$10.P$1 U$5.P$2
  Bottom 0.254: v30.99,13.72 v30.23,14.48 v29.46,13.72 v28.7,14.48 v27.94,13.72 26.67,14.99 v26.42,14.99 | v25.4,15.24 26.16,15.24 v26.42,14.99 | v26.42,14.99 v26.42,13.72 25.91,13.21 | v25.4,13.21 25.91,13.21 | 25.91,13.21 v26.42,12.7 v25.4,11.68 v25.4,9.91 25.65,9.65 v25.65,8.38 26.42,8.38 26.67,8.13 v26.67,7.37 27.18,7.37 v27.94,6.6 v27.94,7.87
  other vias: 6.6,8.38 7.16,5.5 17.02,7.24 11.18,10.92 14.35,2.79 17.27,2.79 11.18,2.79 22.39,2.41
  pour Bottom (isolate 0.381): 0.25,15.62 22.1,15.62 22.1,9.4 13.21,9.4 13.21,10.92 8.13,10.92 8.13,10.41 8.38,10.41 8.38,6.35 13.21,6.35 13.21,9.14 22.1,9.14 22.1,0.25 0.25,0.25
  pour Top (isolate 0.381): 24.89,15.62 32.77,15.62 32.77,0.25 26.16,0.25 26.16,7.49 24.89,7.49
  pour Bottom (isolate 0.381): 24.89,15.62 33.02,15.62 33.02,11.94 34.8,11.94 34.8,0.25 26.16,0.25 26.16,7.49 24.89,7.49
N$1
  Top 0.254: SMDANT.1 33.79,11.93 L1.2
N$2
  Top 0.254: SMDANT.2 34.54,13.34 34.42,13.46 33.53,13.46 33.27,13.72 C13.1
N$3
  Top 0.254: ASWITCH.PIN5 31.5,10.54 C2.2
N$4
  Top 0.254: IMU.P$10 7.67,8.44 C32.1
N$5
  Top 0.508: FB1.1 4.83,4.06 4.32,4.57 4.32,4.68 USB.11
  Top 1.016: USB.6 2.11,11.43 USB.7 | USB.11 2.11,5.23 USB.10
  Top 1.778: USB.7 USB.8 USB.9 USB.10
N$6
  Top 0.254: USB.4 5.41,7.67 R3.1 R5.1
N$7
  Top 0.254: FB2.1 5.06,9.63 USB.1
N$8
  Top 0.254: RGBLED.3 18.54,1.94 R6.2
N$9
  Top 0.254: RGBLED.4 18.45,2.79 18.16,2.79 17.91,2.54 17.91,2.03 17.78,1.91 16.89,1.91 16.64,1.65 R7.2
N$10  (via drill 0.3 pad 0.51)
  Top 0.254: ASWITCH.PIN3 32.15,7.86 32.51,7.49 v32.64,7.49 | v30.23,4.83 30.23,3.94 C11.1
  Bottom 0.254: v32.64,7.49 31.88,7.49 30.23,5.84 v30.23,4.83
N$11  (via drill 0.3 pad 0.51)
  Top 0.254: ASWITCH.PIN1 30.85,7.48 30.73,7.37 v30.48,7.37
  Route15 0.381: v30.48,7.37 31.75,8.64 33.27,8.64 34.42,7.49 C12.1
  other vias: 34.54,7.49
N$13
  Top 0.254: RGBLED.2 19.39,2.03 20.19,2.03 20.45,1.78 R4.2
N$26
  Top 0.254: R1.1 1.07,2.79 BTN_RESET.1
PA06(R)  (via drill 0.3 pad 0.51)
  Top 0.254: IC.7 20.31,5.71 v21.21,5.71
  Route2 0.381: R4.1 19.43,1.78 21.84,4.19 21.84,5.08 v21.21,5.71
  other vias: 19.43,1.27
PA07(G)  (via drill 0.3 pad 0.51)
  Top 0.254: IC.8 19.49,7.24 v19.3,7.24
  Route2 0.381: R6.1 17.53,1.78 18.54,2.79 19.18,2.79 19.68,3.3 19.68,4.06 19.18,4.57 19.18,7.11 v19.3,7.24
  other vias: 17.53,1.27
PA08/I2C  (via drill 0.3 pad 0.51)
  Top 0.254: IC.9 21.08,6.92 v21.08,6.73 | ASWITCH.PIN6 29.65,10.09 v29.46,9.91 29.46,6.6 29.84,6.22 C9.1
  Route15 0.381: U$9.P$2 26.8,1.52 26.04,2.29 26.04,3.43 26.67,4.06 26.67,5.84 | v21.08,6.73 21.46,7.11 25.53,7.11 26.67,5.97 26.67,5.84 | v29.46,9.91 29.46,6.35 28.96,5.84 26.67,5.84
PA09/I2C  (via drill 0.3 pad 0.51)
  Top 0.254: IC.10 20.18,8.64 20.83,8.64 21.46,8 24.77,8 26.67,6.1 26.67,3.17 U$9.P$1 | ASWITCH.PIN4 32.15,10.68 C8.1 31.11,11.94 v29.21,11.94
  Bottom 0.254: v29.21,11.94 31.11,11.94 32.13,10.92 32.13,9.78 31.37,9.02 30.61,9.02 29.46,7.87 29.46,6.35 28.96,5.84 27.43,5.84 26.67,5.08 26.67,3.17 U$9.P$1
PA14/XIN_MC  (via drill 0.3 pad 0.51)
  Top 0.254: IC.15 18.55,10.54 v18.8,10.54 | C3.2 16,15.11 v15.37,15.11 15.11,15.11 14.7,14.7 XTAL_BOARD.1
  Route2 0.254: v18.8,10.54 17.53,10.54 17.02,11.05 17.02,12.95 15.37,14.61 v15.37,15.11
PA15/XOUT_MC  (via drill 0.3 pad 0.51)
  Top 0.254: XTAL_BOARD.3 12.92,12.66 v13.21,12.95 | IC.16 16.38,11.62 C4.1
  Bottom 0.254: U$5.P$8 11.94,14.22 v13.21,12.95 15.37,12.95 C4.1
  other vias: 16.38,11.94
PA16/I2C  (via drill 0.3 pad 0.51)
  Top 0.203: IMU.P$24 12.56,9.64 13.46,10.54 13.46,11.18 13.84,11.56 v14.61,11.56
  Top 0.254: BARO.7 23.77,3.66 23.5,3.94 v23.5,4.45 23.37,4.57 R8.1 | IC.17 16,10.73 16,11.18 15.62,11.56 v14.61,11.56
  Top 0.381: v0.64,13.84 0.64,14.99 0.89,15.24 9.02,15.24 9.27,14.99 U$5.P$7
  Route15 0.305: v0.64,13.84 1.02,13.46 1.02,1.91 2.29,0.64 12.57,0.64 v13.97,2.03
  Route15 0.406: U$5.P$7 9.27,13.59 10.03,12.83 12.06,12.83 13.34,11.56 v14.61,11.56
  Bottom 0.254: v23.5,4.45 22.48,4.45 22.1,4.06 22.1,3.43 21.46,2.79 18.41,2.79 17.78,3.43 16.89,3.43 16,2.54 15.11,2.54 14.61,2.03 v13.97,2.03
PA17/I2C  (via drill 0.3 pad 0.51)
  Top 0.203: IMU.P$23 12.79,9.24 14.1,10.54 v14.1,10.67
  Top 0.254: BARO.8 24.59,6.02 v24.51,6.1 24.51,6.86 24.13,7.24 R9.1 | IC.18 15.23,10.79 14.22,10.79 v14.1,10.67
  Route2 0.381: U$5.P$6 8,13.34 8.51,12.83 12.06,12.83 14.1,10.79 v14.1,10.67
  Route15 0.381: v25.78,1.27 24.51,2.54 v24.51,6.1
  Bottom 0.254: U$5.P$6 8,13.72 7.37,13.08 2.67,13.08 1.78,12.19 1.78,1.14 2.29,0.64 8.64,0.64 10.03,2.03 12.7,2.03 13.46,1.27 14.61,1.27 15.24,1.91 21.72,1.91 22.73,0.89 25.4,0.89 v25.78,1.27
PA18/INTA  (via drill 0.3 pad 0.51)
  Top 0.203: IMU.P$11 8.48,8.04 v8.26,7.81
  Top 0.254: IC.19 16.3,9.02 v16.64,9.02
  Route2 0.381: U$5.P$5 6.73,12.83 7.37,12.19 7.37,11.18 8.51,10.03 8.51,9.91 | v16.64,9.02 16.38,8.76 14.1,8.76 12.45,10.41 11.81,10.41 11.56,10.16 10.79,10.16 10.41,10.54 9.14,10.54 8.51,9.91 | v8.26,7.81 8.51,8.06 8.51,9.91
PA19/FSYNC  (via drill 0.3 pad 0.51)
  Top 0.203: IMU.P$12 9.17,7.26 9.02,7.11 v8.57,7.11
  Top 0.254: IC.20 14.86,9.75 v14.86,10.16
  Route2 0.381: v8.57,7.11 9.08,6.6 14.22,6.6 14.99,5.84 15.62,5.84 16.26,6.48 16.26,7.49 17.53,8.76 17.53,9.4 15.75,11.18 | U$5.P$4 5.46,14.86 5.84,15.24 11.18,15.24 12.7,13.72 14.61,13.72 15.49,12.83 15.49,11.43 15.75,11.18 | v14.86,10.16 15.75,11.05 15.75,11.18
PA24/USBDM  (via drill 0.3 pad 0.51)
  Top 0.254: USB.2 3.93,9.02 7.62,9.02 7.75,9.14 v7.75,9.65 | IC.22 15.2,8 v15.49,8
  Bottom 0.254: v15.49,8 15.62,8.13 15.62,11.56 14.99,12.19 12.7,12.19 12.06,12.83 10.03,12.83 7.75,10.54 v7.75,9.65
PA25/USBDP  (via drill 0.3 pad 0.51)
  Top 0.254: USB.3 5.28,8.33 v5.33,8.38 | IC.23 14.99,7.5 v14.99,7.37
  Bottom 0.254: v14.99,7.37 14.86,7.38 14.22,8.01 14.22,8.64 13.21,9.65 13.21,11.19 12.84,11.56 12.43,11.56 12.06,11.19 12.06,10.67 11.68,10.29 10.67,10.29 10.41,10.54 10.41,11.43 10.22,11.62 9.84,11.62 8.64,10.41 8.64,9.27 8.26,8.89 7.24,8.89 6.99,9.14 6.1,9.14 v5.33,8.38
PA27(B)  (via drill 0.3 pad 0.51)
  Top 0.254: IC.25 13.08,5.78 v13.08,5.46
  Route2 0.305: v13.08,5.46 11.68,5.46 10.67,4.45 9.02,4.45 8.89,4.57 2.54,4.57 1.14,3.17 1.14,1.78 2.29,0.64 15.11,0.64 R7.1
  other vias: 15.62,1.14
PA28  (via drill 0.3 pad 0.51)
  Top 0.254: R3.2 7.37,7.62 v7.62,7.37 | IC.27 15.32,6.6 v15.37,6.6
  Bottom 0.254: v15.37,6.6 15.24,6.48 8.13,6.48 7.62,6.99 v7.62,7.37
PA30/SWCLK  (via drill 0.3 pad 0.51)
  Top 0.254: IC.31 16.38,4.84 v16.38,5.46
  Bottom 0.254: U$10.P$4 6.73,2.67 7.24,3.17 7.49,3.17 8.64,4.32 11.43,4.32 12.19,3.56 13.08,3.56 13.59,4.06 15.11,4.06 16.38,5.33 v16.38,5.46
PA31/SWDIO  (via drill 0.3 pad 0.51)
  Top 0.254: IC.32 15.88,3.62 v15.88,3.56
  Bottom 0.254: U$10.P$5 8,2.67 9.02,3.68 11.18,3.68 11.81,3.05 13.46,3.05 13.97,3.56 v15.88,3.56
RESET  (via drill 0.3 pad 0.51)
  Top 0.254: R2.2 5.08,1.91 U$10.P$3 | R2.2 C1.1 | R1.2 3.05,3.3 3.3,3.56 4.45,3.56 5.08,2.92 R2.2 | IC.26 13.84,5.83 13.84,5.21 13.46,4.83 v13.46,4.7
  Bottom 0.254: v13.46,4.7 13.34,4.83 11.94,4.83 10.92,5.84 8.64,5.84 7.37,4.57 6.35,4.57 5.46,3.68 U$10.P$3
RFN
  Top 0.254: IC.13 19.71,10.29 22.48,10.29 22.99,10.79 26.52,10.79 BALUN.3
RFP
  Top 0.254: IC.12 19.79,9.65 22.35,9.65 22.99,9.02 26.52,9.02 BALUN.4
VDDANA  (via drill 0.3 pad 0.51)
  Top 0.254: C22.2 20.66,12.79 C_ARR.1 20,12.39 v20.07,12.32 | IC.4 19.71,4.19 20.32,4.19 20.81,4.68 L6.2
  Bottom 0.254: L6.2 20.89,5.02 20.32,5.59 20.07,5.59 18.54,7.11 18.54,7.75 20.19,9.4 20.19,12.19 v20.07,12.32
  other vias: 20.89,4.68
VDDCORE  (via drill 0.3 pad 0.51)
  Top 0.254: C_ARR.7 17.6,11.74 v17.65,11.68 | IC.29 14.83,4.7 v14.35,4.7
  Bottom 0.254: v14.35,4.7 14.61,4.7 16.26,6.35 16.26,7.49 17.53,8.76 17.53,11.56 v17.65,11.68
VIN  (via drill 0.3 pad 0.51)
  Top 0.254: v11.56,13.59 10.67,12.95 C6.1
  Top 0.508: LDO_VREG.VIN 9.91,11.94 | 9.91,11.94 10.16,11.68 C7.1 | 9.91,11.94 10.16,12.19 C6.1
  Route2 0.508: FB2.2 4.06,9.78 1.91,11.94 1.91,13.97 U$5.P$1
  Bottom 0.381: FB2.2 6.73,11.18 8.89,13.34 11.3,13.34 v11.56,13.59
  other vias: 6.73,9.78
XTALIN  (via drill 0.3 pad 0.51)
  Top 0.254: IC.2 17.41,5.08 v17.14,5.08
  Route2 0.381: v17.14,5.08 16.51,4.45 15.49,4.45 14.61,3.56 13.21,3.56 13.08,3.43 11.94,3.43 11.56,3.81 9.4,3.81 9.14,3.56 C14.2
  Route15 0.508: C14.2 9.14,3.43 8.76,3.81 7.24,3.81 XTAL_RF.1
  other vias: 7.16,3.9 9.14,2.79
XTALOUT  (via drill 0.3 pad 0.51)
  Top 0.254: XTAL_RF.3 9.49,5.5 v9.53,5.21 | IC.1 18.1,3.68 v18.8,3.68 | C15.1 10.16,1.91 v10.67,1.4
  Route2 0.381: v25.65,5.84 25.65,2.54 24.77,1.65 21.97,1.65 21.59,2.03 20.83,2.03 20.57,1.78 20.57,1.14 19.94,0.51 17.27,0.51 16.76,1.02 16.76,1.52 16.38,1.91 15.24,1.91 14.61,1.27 10.79,1.27 v10.67,1.4
  Route15 0.508: v9.53,5.21 9.53,4.7 10.03,4.19 10.03,2.03 v10.67,1.4
  Bottom 0.254: v18.8,3.68 21.34,3.68 21.46,3.81 21.46,4.32 22.35,5.21 25.02,5.21 v25.65,5.84

### Text on the board
tPlace: + | - | FS | IN | D0 | D1 | BOOT | 3V3 | BOOT | D7 | D8 | uFL
bPlace: VIN | GND | 3V3 | D0/I2C | D1/I2C | r3.0.1 | PRO | FemtoBeacon | Femto.io | BOOT | RESET | D4/FSYNC | D3/INT | 3V3 | SWDIO | D7/I2C | GND | D8/I2C | SWCLK